# EAGLE design Sphyg X Link Adaptor (EAGLE 9.6.2)
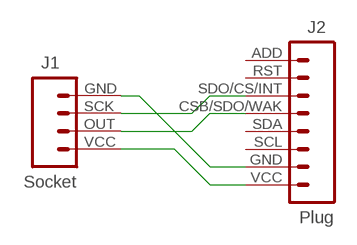
[diagram p0: schematic, sheet 1]

## Parts
J1  Socket  HEADER-1X4-SHPYG  [CONN_04-SPHYG]
J2  Plug  HEADER-1X8-ALF4ALL-SENSOR  [CONN_08-SENSOR]

## Nets
N$1: J1.OUT J2.CSB/SDO/WAK
N$2: J1.SCK J2.SDO/CS/INT
N$4: J1.VCC J2.VCC
N$7: J1.GND J2.GND
Unconnected: J2.ADD J2.RST J2.SCL J2.SDA

## Library data of the parts
J1 = digitalconcepts:HEADER-1X4-SHPYG: Sphygmomanometer Module 4-Pin Header
J2 = digitalconcepts:HEADER-1X8-ALF4ALL-SENSOR: IoT Sensors 1x8 Pin Header for 'Sandwich' IoT Sensors

## Board
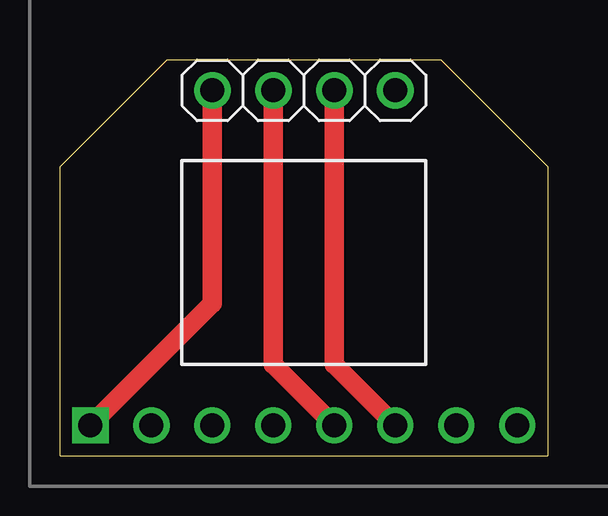
[diagram p1: board, top side]
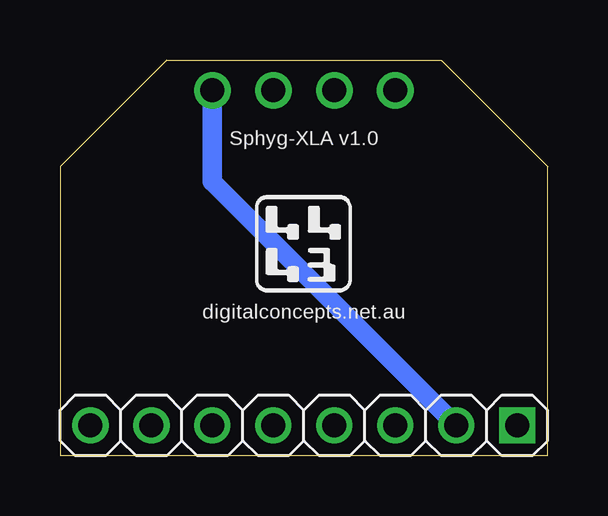
[diagram p2: board, bottom side, seen from below]

Size 20.32 x 16.51 mm. Coordinates in mm from the lower left corner, seen from the top.
Outline: 0,0 20.32,0 20.32,12.07 15.88,16.51 4.45,16.51 0,12.07 0,0
Copper layers (1*16): Top 0.035mm / dielectric 1.5mm / Bottom 0.035mm
Design rules "default *": minimum track width 6mil, minimum drill 0.35mm, track to track 6mil, track to pad 6mil, pad to pad 6mil, via to via 6mil, smd to smd 6mil, copper to edge 15mil, drill to drill 6mil, minimum pad ring 10mil, minimum via ring 8mil, stop-mask expansion 4mil, vias tented up to drill 0mil, thermal gap 10mil

### Footprints (pad centres in the part's own frame; a part is rotated, then mirrored left to right if it is on the bottom)
CONN_04-SPHYG = drill 1 pad 1.524: GND 7.62,0; OUT 2.54,0; SCK 5.08,0; VCC 0,0
CONN_08-SENSOR = drill 1: ADD 17.78,0; CSB/SDO/WAK 10.16,0; GND 2.54,0; RST 15.24,0; SCL 5.08,0; SDA 7.62,0; SDO/CS/INT 12.7,0 | drill 1 square: VCC 0,0

### Placement (x,y rotation side)
J1  6.35,15.24 0 top
J2  1.27,1.27 180 bottom

### Tracks (layer width: path | path; a pad name or v marks a point on that pad's centre or on a via)
N$1
  Top 0.813: J2.CSB/SDO/WAK 8.89,3.81 J1.OUT
N$2
  Top 0.813: J1.SCK 11.43,3.81 J2.SDO/CS/INT
N$4
  Top 0.813: J1.VCC 6.35,6.35 J2.VCC
N$7
  Bottom 0.813: J1.GND 13.97,11.43 J2.GND

### Text on the board
bPlace: Sphyg-XLA v1.0 | digitalconcepts.net.au